# EAGLE schematic Arachnode (EAGLE 6.5.0)

## Sheet 1 of 2
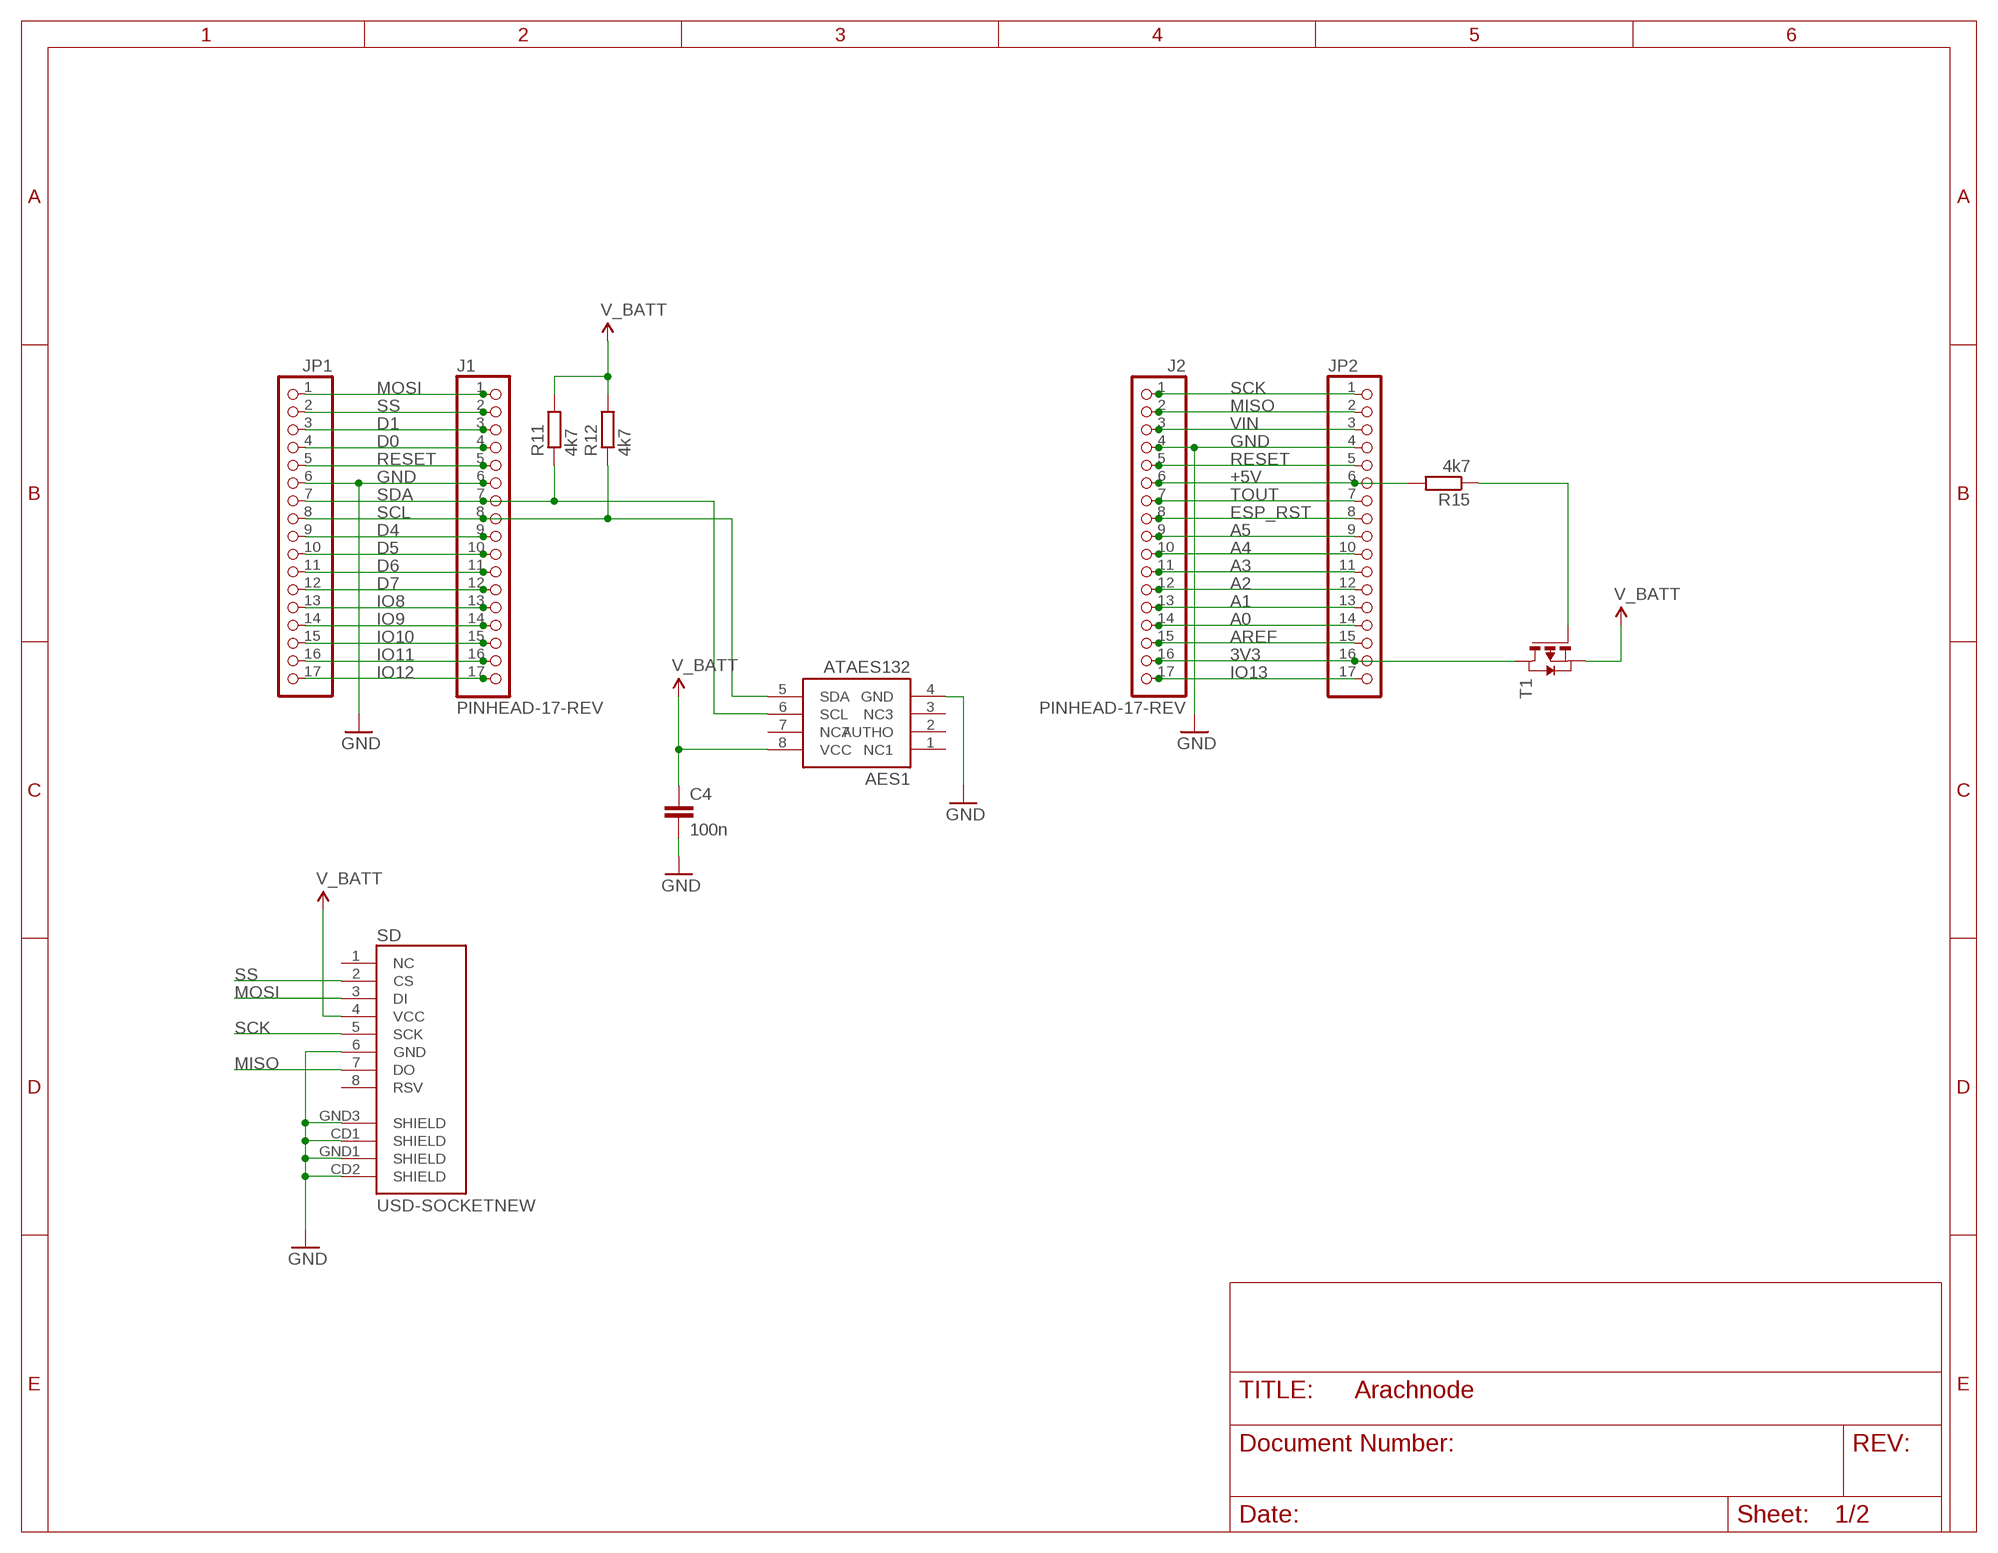
[diagram p0: schematic, sheet 1]

### Parts
AES1  ATAES132  [SOIC8]
C4  100n  C-EUC0603  [C0603]
J1  PINHEAD-17-REV  [4UCONN-12573]
J2  PINHEAD-17-REV  [4UCONN-12573]
JP1  PINHD-1X17_2.54  [1X17]
JP2  PINHD-1X17_2.54  [1X17]
R11  4k7  R-EU_R0603  [R0603]
R12  4k7  R-EU_R0603  [R0603]
R15  4k7  R-EU_R0603  [R0603]
SD  USD-SOCKETNEW  [MICRO-SD-SOCKET-PP]
T1  PMOSSOT23  [SOT-23]

### Nets
3V3: J2.16 J2.33 J2.50 JP2.16 T1.1(D)
+5V: J2.6 J2.23 J2.40 JP2.6 R15.2
A0: J2.14 J2.31 J2.48 JP2.14 ; also sheet 2
A1: J2.13 J2.30 J2.47 JP2.13 ; also sheet 2
A2: J2.12 J2.29 J2.46 JP2.12
A3: J2.11 J2.28 J2.45 JP2.11
A4: J2.10 J2.27 J2.44 JP2.10
A5: J2.9 J2.26 J2.43 JP2.9
AREF: J2.15 J2.32 J2.49 JP2.15
D0: J1.4 J1.21 J1.38 JP1.4
D1: J1.3 J1.20 J1.37 JP1.3
D4: J1.9 J1.26 J1.43 JP1.9
D5: J1.10 J1.27 J1.44 JP1.10
D6: J1.11 J1.28 J1.45 JP1.11
D7: J1.12 J1.29 J1.46 JP1.12
ESP_RST: J2.8 J2.25 J2.42 JP2.8
GND: AES1.4(GND) C4.2 J1.6 J1.23 J1.40 J2.4 J2.21 J2.38 JP1.6 JP2.4 SD.6(GND) SD.CD1(SHIELD) SD.CD2(SHIELD) SD.GND1(SHIELD) SD.GND3(SHIELD) ; also sheet 2
IO8: J1.13 J1.30 J1.47 JP1.13
IO9: J1.14 J1.31 J1.48 JP1.14
IO10: J1.15 J1.32 J1.49 JP1.15
IO11: J1.16 J1.33 J1.50 JP1.16
IO12: J1.17 J1.34 J1.51 JP1.17
IO13: J2.17 J2.34 J2.51 JP2.17
MISO: J2.2 J2.19 J2.36 JP2.2 SD.7(DO)
MOSI: J1.1 J1.18 J1.35 JP1.1 SD.3(DI)
N$1: R15.1 T1.3(G)
RESET: J1.5 J1.22 J1.39 J2.5 J2.22 J2.39 JP1.5 JP2.5
SCK: J2.1 J2.18 J2.35 JP2.1 SD.5(SCK)
SCL: AES1.5(SDA) J1.8 J1.25 J1.42 JP1.8 R12.1
SDA: AES1.6(SCL) J1.7 J1.24 J1.41 JP1.7 R11.1
SS: J1.2 J1.19 J1.36 JP1.2 SD.2(CS)
TOUT: J2.7 J2.24 J2.41 JP2.7
V_BATT: AES1.8(VCC) C4.1 R11.2 R12.2 SD.4(VCC) T1.2(S) ; also sheet 2
VIN: J2.3 J2.20 J2.37 JP2.3 ; also sheet 2
Unconnected: AES1.1(NC1) AES1.2(AUTHO) AES1.3(NC3) AES1.7(NC7) SD.1(NC) SD.8(RSV)

## Sheet 2 of 2
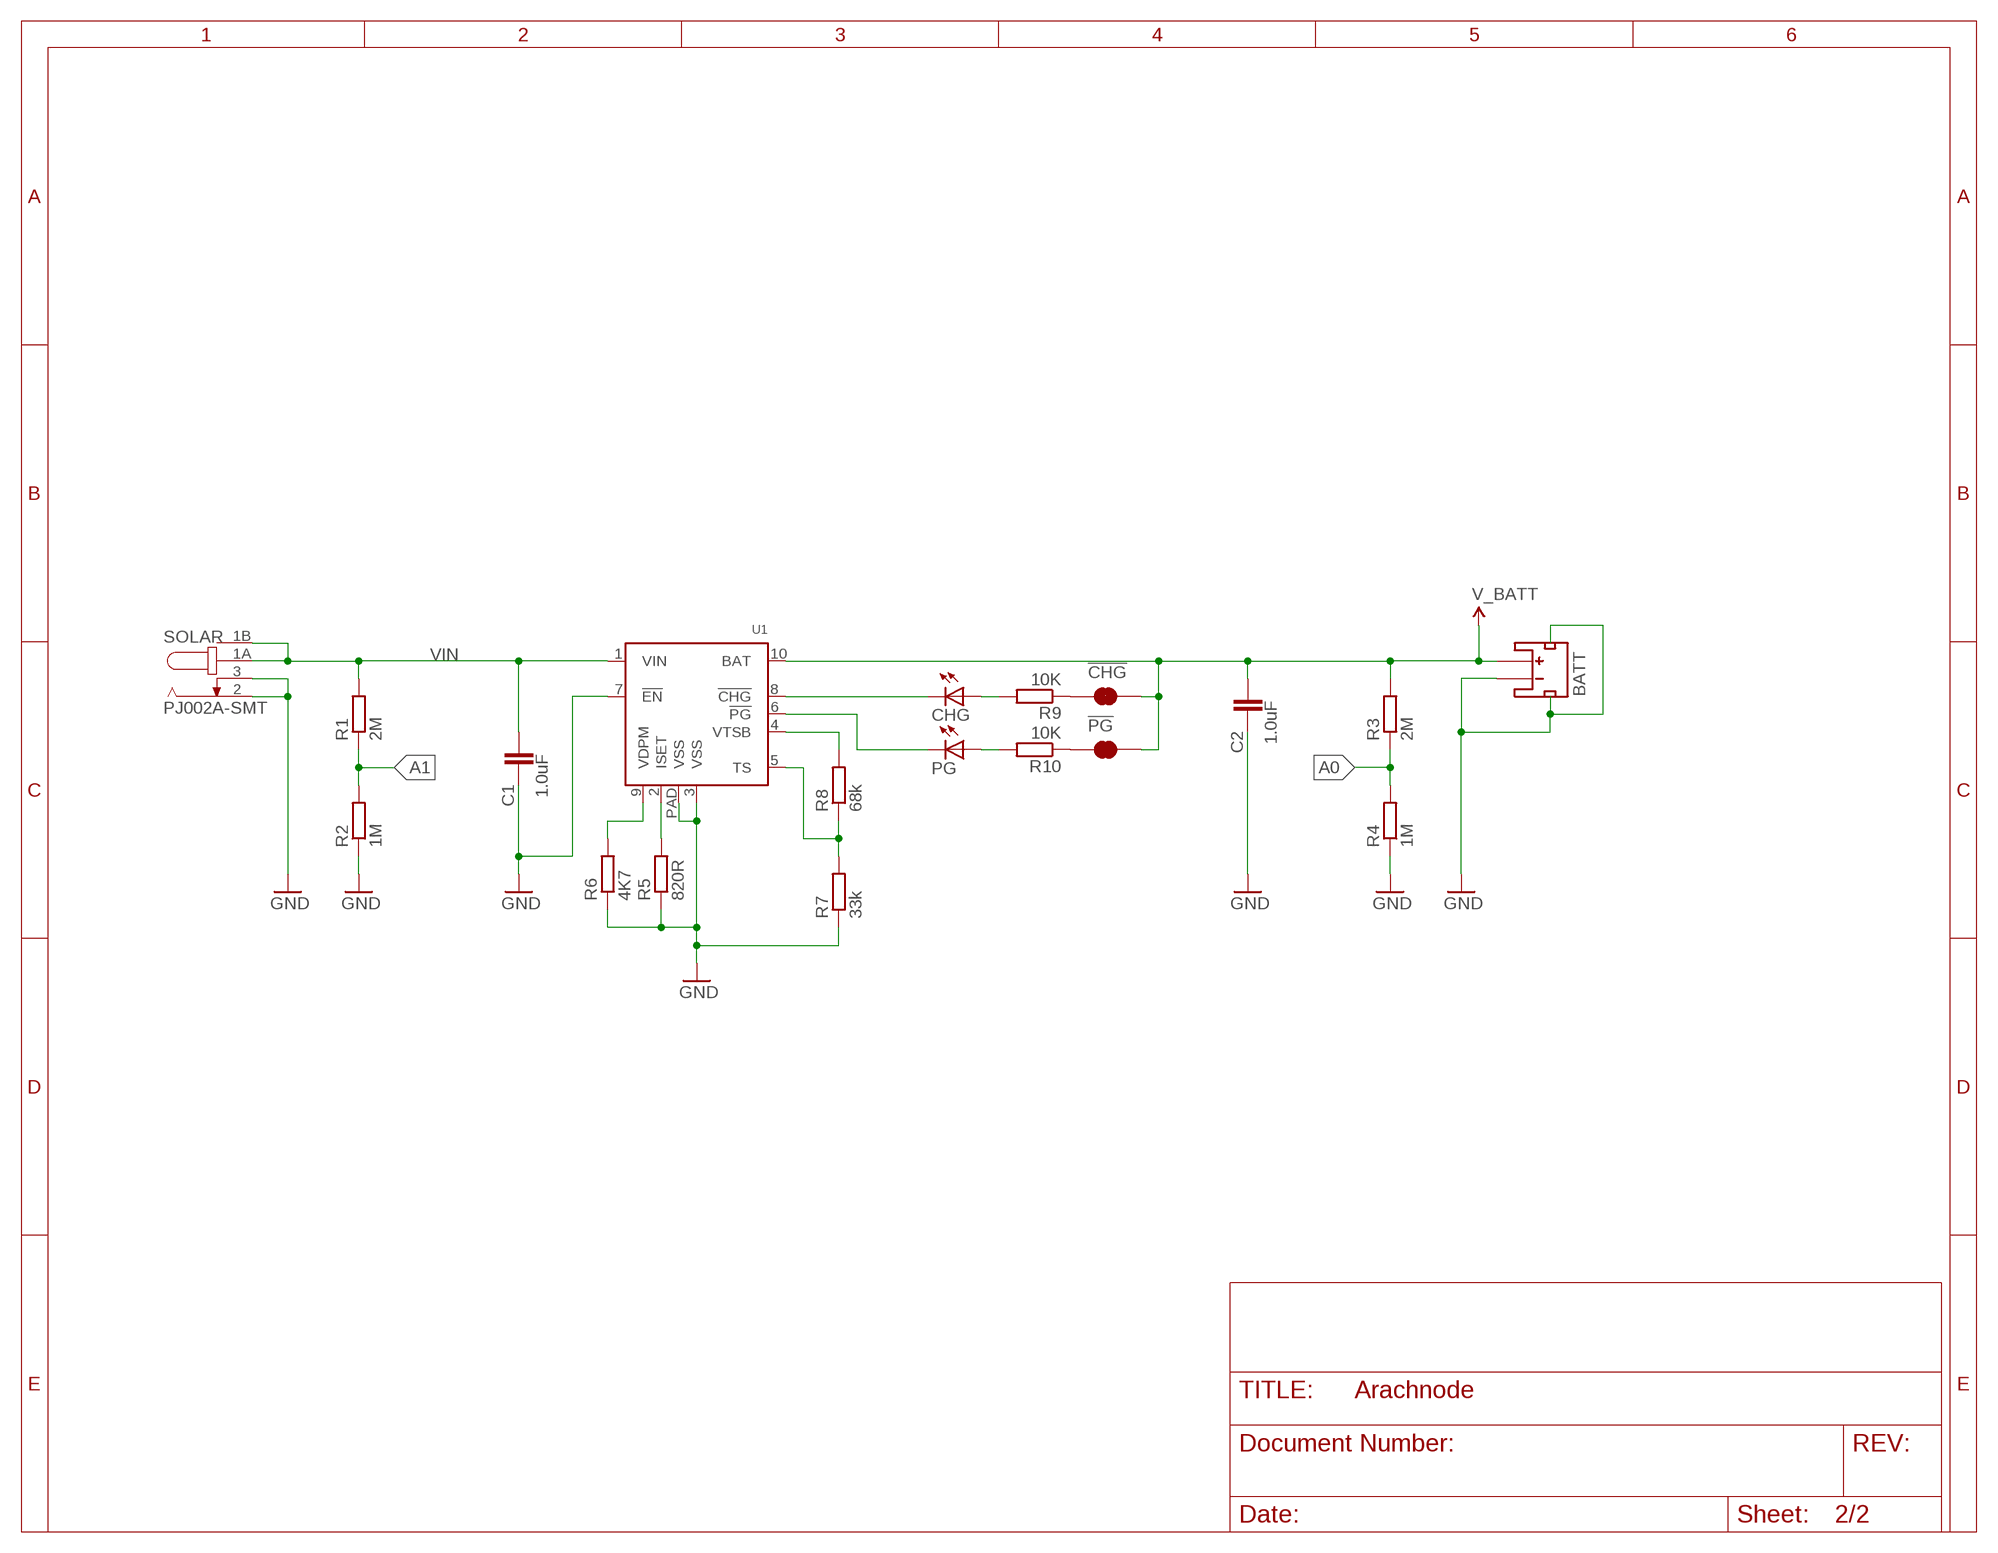
[diagram p1: schematic, sheet 2]

### Parts
!CHG!  JUMPER-PAD-2-NC_BY_TRACE  [PAD-JUMPER-2-NC_BY_TRACE_YES_SILK]
!PG!  JUMPER-PAD-2-NC_BY_TRACE  [PAD-JUMPER-2-NC_BY_TRACE_YES_SILK]
BATT  JST_2MM_MALE  [JST-2-SMD]
C1  1.0uF  C-EUC0603  [C0603]
C2  1.0uF  C-EUC0603  [C0603]
CHG  LEDCHIP-LED0603  [CHIP-LED0603]
PG  LEDCHIP-LED0603  [CHIP-LED0603]
R1  2M  R-EU_R0603  [R0603]
R2  1M  R-EU_R0603  [R0603]
R3  2M  R-EU_R0603  [R0603]
R4  1M  R-EU_R0603  [R0603]
R5  820R  R-EU_R0603  [R0603]
R6  4K7  R-EU_R0603  [R0603]
R7  33k  R-EU_R0603  [R0603]
R8  68k  R-EU_R0603  [R0603]
R9  10K  R-EU_R0603  [R0603]
R10  10K  R-EU_R0603  [R0603]
SOLAR  PJ002A-SMT  [PJ002A-SMT]
U1  BQ24210  [WSON-10]

### Nets
A0: R3.1 R4.2 ; also sheet 1
A1: R1.1 R2.2 ; also sheet 1
GND: BATT.1(-) BATT.NC1(PAD1) BATT.NC2(PAD2) C1.1 C2.1 R2.1 R4.1 R5.1 R6.1 R7.1 SOLAR.2 SOLAR.3 U1.3(VSS) U1.7(!EN!) U1.PAD(VSS) ; also sheet 1
N$3: PG.A R10.2
N$5: R5.2 U1.2(ISET)
N$6: CHG.A R9.2
N$7: R6.2 U1.9(VDPM)
N$8: R7.2 R8.1 U1.5(TS)
N$9: PG.C U1.6(!PG!)
N$10: R8.2 U1.4(VTSB)
N$11: CHG.C U1.8(!CHG!)
N$12: !CHG!.1 R9.1
N$13: !PG!.1 R10.1
V_BATT: !CHG!.2 !PG!.2 BATT.2(+) C2.2 R3.2 U1.10(BAT) ; also sheet 1
VIN: C1.2 R1.2 SOLAR.1A SOLAR.1B U1.1(VIN) ; also sheet 1

## Library data of the parts
!CHG! !PG! = SparkFun-Passives:JUMPER-PAD-2-NC_BY_TRACE
AES1 = SparkFun-DigitalIC:ATAES132: 32Kb Serial EEPROM. AES-128-CCM. MAC. Secure Storage for 128-bit keys. Encrypted User Memory Readn and Write. HWRNG. 2.5V to 5.5V.; PROD_ID: IC-11983
BATT = SparkFun-Connectors:JST_2MM_MALE: Mates to single-cell LiPo batteries. CONN-08352; PARTNO: S2B-PH-SM4-TB(LF)(SN); PROD_ID: CONN-08352
C1 C2 C4 = resistor:C-EU: CAPACITOR, European symbol
CHG PG = adafruit:LED: LED OSRAM: - CHIPLED LG R971, LG N971, LY N971, LG Q971, LY Q971, LO R971, LY R971 LH N974, LH R974 LS Q976, LO Q976, LY Q976 LO Q996 - Hyper CHIPLED LW Q18S LB Q993, LB Q99A, LB R99A - SideLED LS A670, LO A670, LY A670, LG A670, LP A670 LB A673, LV A673, LT A673, LW A673 LH A674 LY A675 LS A676, LA A676, LO A676, LY A676, LW A676 LS A679, LY A679, LG A679 - Hyper Micro SIDELED® LS Y876, LA Y876, LO Y876, LY Y876 LT Y87S - SmartLED LW L88C, LW L88S LB L89C, LB L89S, LG L890 LS L89K, LO L89K, LY L89K LS L896, LA L896, LO L896, LY L896 - TOPLED LS T670, LO T670, LY T670, LG T670, LP T670 LSG T670, LSP T670, LSY T670, LOP T670, LYG T670 LG T671, LOG T671, LSG T671 LB T673, LV T673, LT T673, LW T673 LH T674 LS T676, LA T676, LO T676, LY T676, LB T676, LH T676, LSB T676, LW T676 LB T67C, LV T67C, LT T67C, LS T67K, LO T67K, LY T67K, LW E67C LS E67B, LA E67B, LO E67B, LY E67B, LB E67C, LV E67C, LT E67C LW T67C LS T679, LY T679, LG T679 LS T770, LO T770, LY T770, LG T770, LP T770 LB T773, LV T773, LT T773, LW T773 LH T774 LS E675, LA E675, LY E675, LS T675 LS T776, LA T776, LO T776, LY T776, LB T776 LHGB T686 LT T68C, LB T68C - Hyper Mini TOPLED® LB M676 - Mini TOPLED Santana® LG M470 LS M47K, LO M47K, LY M47K Source: http://www.osram.convergy.de/
J1 J2 = logos-headers:PINHEAD-17-REV
JP1 JP2 = logos-headers:PINHD-1X17: PIN HEADER
R1 R3 R5-R12 R15 = resistor:R-EU_: RESISTOR, European symbol
R2 R4 = resistor:R-EU_: RESISTOR, European symbol; PARTNO: ERJ-3EKF1004V
SD = SparkFun-Connectors:USD-SOCKET: microSD Socket Push-push type uSD socket. Schematic element and footprint production proven. Spark Fun Electronics SKU : PRT-00127. tDoc lines correctly indicate media card edge positions when inserting (unlocked, locked, depressed).; PARTNO: 502570-0893
SOLAR = logos-headers:PJ002A; PARTNO: PJ-002AH-SMT
T1 = zetex:PMOSSOT23: MOS FET; OC_FARNELL: unknown; OC_NEWARK: unknown
U1 = logos-power:BQ24210

## Net classes
0 default: width 0.152 mm, drill 0.33 mm, clearance 0.152 mm